# Altium project X-Sub_Board.PrjPcb
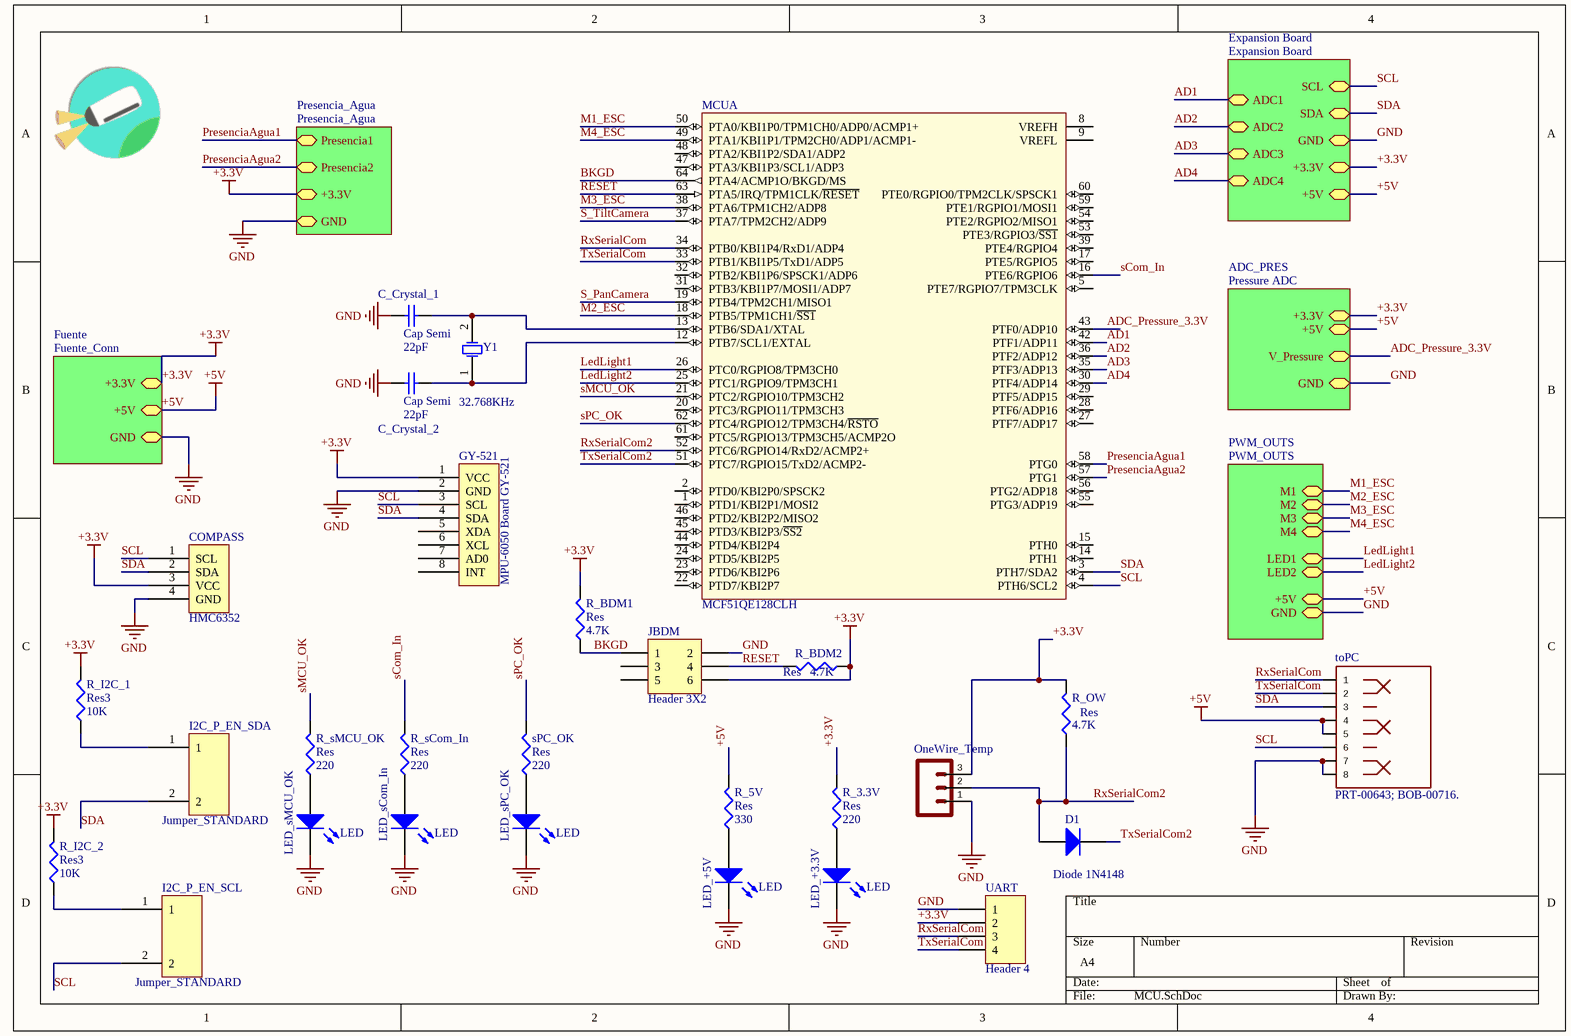
[diagram p0: MCU.SchDoc]
5 sheets, 44 parts. Net scope: hierarchical (ports join the sheet entries above them; power ports are global).
Board file: MCU.PcbDoc
Sheets:
  MCU.SchDoc
    Fuente = Fuente_Conn.SchDoc
    Expansion Board = Expansion Board.SchDoc
    ADC_PRES = Pressure ADC.SchDoc
    Presencia_Agua = Presencia_Agua.SchDoc

## Sheet MCU.SchDoc
size A4; PageSetup: Record=PageOptions|CenterHorizontal=True|CenterVertical=True|PrintScale=0.98|XCorrection=1.00|YCorrection=1.00|PrintKind=1|BorderSize=5000000|LeftOffset=0|BottomOffset=0|Orientation=2|PaperLength=1000|PaperWidth=1000|Scale=100|PaperSource=7|PrintQuality=-3|MediaType=1|DitherType=10|PrintScaleMode=1|PaperKind=Carta|PaperIndex=1

### Parts
C_Crystal_1  Cap Semi  value 22pF  [1608[0603]]
C_Crystal_2  Cap Semi  value 22pF  [1608[0603]]
COMPASS  HMC6352  [HMC6352_SF]
D1  Diode 1N4148  [DO-35]
GY-521  MPU-6050 Board GY-521  [GY-521]
I2C_P_EN_SCL  Jumper_STANDARD  [HDR1X2]
I2C_P_EN_SDA  Jumper_STANDARD  [HDR1X2]
JBDM  Header 3X2  [HDR2X3]
LED_+3.3V  LED  [3.2X1.6X1.1]
LED_+5V  LED  [3.2X1.6X1.1]
LED_sCom_In  LED  [3.2X1.6X1.1]
LED_sMCU_OK  LED  [3.2X1.6X1.1]
LED_sPC_OK  LED  [3.2X1.6X1.1]
MCU  MCF51QE128CLH  [840F-02_N]  (part A of 2)
OneWire_Temp  (no value)  [SCREWTERMINAL-5MM-3]
R_3.3V  Res  value 220  [RESC6332]
R_5V  Res  value 330  [RESC6332]
R_BDM1  Res  value 4.7K  [RESC6332]
R_BDM2  Res  value 4.7K  [RESC6332]
R_I2C_1  Res3  value 10K  [RESC6332]
R_I2C_2  Res3  value 10K  [RESC6332]
R_OW  Res  value 4.7K  [RESC6332]
R_sCom_In  Res  value 220  [RESC6332]
R_sMCU_OK  Res  value 220  [RESC6332]
sPC_OK  Res  value 220  [RESC6332]
toPC  PRT-00643; BOB-00716.  [RJ45-8]
UART  Header 4  [HDR1X4]
Y1  32.768KHz  [R38]

### Sub-sheets
ADC_PRES = Pressure ADC: +3.3V, GND, V_Pressure, +5V
Expansion Board = Expansion Board: SCL, SDA, GND, +3.3V, +5V, ADC4, ADC1, ADC2, ADC3
Fuente = Fuente_Conn: +3.3V, +5V, GND
Presencia_Agua = Presencia_Agua: GND, +3.3V, Presencia2, Presencia1
PWM_OUTS = PWM_OUTS (file not in this document): M1, M2, M3, M4, LED1, LED2, +5V, GND

### Nets
+3.3V: COMPASS.3(VCC) GY-521.1(VCC) JBDM.6 OneWire_Temp.3 R_3.3V.2 R_BDM1.2 R_BDM2.1 R_I2C_1.2 R_I2C_2.2 R_OW.2 UART.2 ; sheet Fuente/+3.3V, sheet Expansion Board/+3.3V, sheet ADC_PRES/+3.3V, sheet Presencia_Agua/+3.3V
+5V: R_5V.2 toPC.4 toPC.5 ; sheet Fuente/+5V, sheet Expansion Board/+5V, sheet ADC_PRES/+5V, sheet PWM_OUTS/+5V
GND: C_Crystal_1.1 C_Crystal_2.1 COMPASS.4(GND) GY-521.2(GND) JBDM.2 LED_+3.3V.2(K) LED_+5V.2(K) LED_sCom_In.2(K) LED_sMCU_OK.2(K) LED_sPC_OK.2(K) OneWire_Temp.1 toPC.7 toPC.8 UART.1 ; sheet Fuente/GND, sheet Expansion Board/GND, sheet ADC_PRES/GND, sheet PWM_OUTS/GND, sheet Presencia_Agua/GND
AD1: MCU.42(PTF1/ADP11) ; sheet Expansion Board/ADC1
AD2: MCU.36(PTF2/ADP12) ; sheet Expansion Board/ADC2
AD3: MCU.35(PTF3/ADP13) ; sheet Expansion Board/ADC3
AD4: MCU.30(PTF4/ADP14) ; sheet Expansion Board/ADC4
ADC_Pressure_3.3V: MCU.43(PTF0/ADP10) ; sheet ADC_PRES/V_Pressure
BKGD: JBDM.1 MCU.64(PTA4/ACMP1O/BKGD/MS) R_BDM1.1
LedLight1: MCU.26(PTC0/RGPIO8/TPM3CH0) ; sheet PWM_OUTS/LED1
LedLight2: MCU.25(PTC1/RGPIO9/TPM3CH1) ; sheet PWM_OUTS/LED2
M1_ESC: MCU.50(PTA0/KBI1P0/TPM1CH0/ADP0/ACMP1+) ; sheet PWM_OUTS/M1
M2_ESC: MCU.18(PTB5/TPM1CH1/~{SS1}) ; sheet PWM_OUTS/M2
M3_ESC: MCU.38(PTA6/TPM1CH2/ADP8) ; sheet PWM_OUTS/M3
M4_ESC: MCU.49(PTA1/KBI1P1/TPM2CH0/ADP1/ACMP1-) ; sheet PWM_OUTS/M4
PresenciaAgua1: MCU.58(PTG0) ; sheet Presencia_Agua/Presencia1
PresenciaAgua2: MCU.57(PTG1) ; sheet Presencia_Agua/Presencia2
RESET: JBDM.4 MCU.63(PTA5/IRQ/TPM1CLK/~{RESET}) R_BDM2.2
RxSerialCom: MCU.34(PTB0/KBI1P4/RxD1/ADP4) toPC.1 UART.3
RxSerialCom2: D1.1(A) MCU.52(PTC6/RGPIO14/RxD2/ACMP2+) OneWire_Temp.2 R_OW.1
S_PanCamera: MCU.19(PTB4/TPM2CH1/MISO1)
S_TiltCamera: MCU.37(PTA7/TPM2CH2/ADP9)
SCL: COMPASS.1(SCL) GY-521.3(SCL) I2C_P_EN_SCL.2 MCU.4(PTH6/SCL2) toPC.6 ; sheet Expansion Board/SCL
sCom_In: MCU.16(PTE6/RGPIO6) R_sCom_In.2
SDA: COMPASS.2(SDA) GY-521.4(SDA) I2C_P_EN_SDA.2 MCU.3(PTH7/SDA2) toPC.3 ; sheet Expansion Board/SDA
sMCU_OK: MCU.21(PTC2/RGPIO10/TPM3CH2) R_sMCU_OK.2
sPC_OK: MCU.62(PTC4/RGPIO12/TPM3CH4/~{RSTO}) sPC_OK.2
TxSerialCom: MCU.33(PTB1/KBI1P5/TxD1/ADP5) toPC.2 UART.4
TxSerialCom2: D1.2(K) MCU.51(PTC7/RGPIO15/TxD2/ACMP2-)
NetC_Crystal_1_2: C_Crystal_1.2 MCU.13(PTB6/SDA1/XTAL) Y1.2(OSC2)
NetC_Crystal_2_2: C_Crystal_2.2 MCU.12(PTB7/SCL1/EXTAL) Y1.1(OSC1)
NetI2C_P_EN_SCL_1: I2C_P_EN_SCL.1 R_I2C_2.1
NetI2C_P_EN_SDA_1: I2C_P_EN_SDA.1 R_I2C_1.1
NetLED_+3.3V_1: LED_+3.3V.1(A) R_3.3V.1
NetLED_+5V_1: LED_+5V.1(A) R_5V.1
NetLED_sCom_In_1: LED_sCom_In.1(A) R_sCom_In.1
NetLED_sMCU_OK_1: LED_sMCU_OK.1(A) R_sMCU_OK.1
NetLED_sPC_OK_1: LED_sPC_OK.1(A) sPC_OK.1

Not connected (* = marked no-connect by the designer): GY-521 5(XDA) 6(XCL) 7(AD0) 8(INT); JBDM 3 5; MCU 1(PTD1/KBI2P1/MOSI2) 2(PTD0/KBI2P0/SPSCK2) 5(PTE7/RGPIO7/TPM3CLK) 8(VREFH) 9(VREFL) 14(PTH1) 15(PTH0) 17(PTE5/RGPIO5) 20(PTC3/RGPIO11/TPM3CH3) 22(PTD7/KBI2P7) 23(PTD6/KBI2P6) 24(PTD5/KBI2P5) 27(PTF7/ADP17) 28(PTF6/ADP16) 29(PTF5/ADP15) 31(PTB3/KBI1P7/MOSI1/ADP7) 32(PTB2/KBI1P6/SPSCK1/ADP6) 39(PTE4/RGPIO4) 44(PTD4/KBI2P4) 45(PTD3/KBI2P3/~{SS2}) 46(PTD2/KBI2P2/MISO2) 47(PTA3/KBI1P3/SCL1/ADP3) 48(PTA2/KBI1P2/SDA1/ADP2) 53(PTE3/RGPIO3/~{SS1}) 54(PTE2/RGPIO2/MISO1) 55(PTG3/ADP19) 56(PTG2/ADP18) 59(PTE1/RGPIO1/MOSI1) 60(PTE0/RGPIO0/TPM2CLK/SPSCK1) 61(PTC5/RGPIO13/TPM3CH5/ACMP2O)

### Library data of the parts
C_Crystal_1 C_Crystal_2 = Cap Semi: Capacitor (Semiconductor SIM Model); Published: 8-Jun-2000; LatestRevisionDate: 29-May-2009; LatestRevisionNote: IPC-7351 Footprint Added.; PackageReference: C1206; Publisher: Altium Limited; PackageDescription: Chip Capacitor
D1 = Diode 1N4148: High Conductance Fast Diode; Published: 8-Jun-2000; LatestRevisionDate: 17-Jul-2002; LatestRevisionNote: Re-released for DXP Platform.; DatasheetVersion: 1997; PackageReference: DO-35; Publisher: Altium Limited; PackageDescription: Diode, Axial; Body 3.8 x 1.9 mm (LxDia. max), Lead Dia. 0.53 mm (max); Code_JEDEC: DO-204-AH; ComponentLink1Description: Manufacturer Link; ComponentLink1URL: http://www.fairchildsemi.com/; ComponentLink2Description: Datasheet; ComponentLink2URL: http://www.fairchildsemi.com/ds/1N%2F1N4148.pdf
GY-521 = GY-521
I2C_P_EN_SCL I2C_P_EN_SDA = Jumper_STANDAR
JBDM = Header 3X2: Header, 3-Pin, Dual row; LatestRevisionDate: 17-Jul-2002; LatestRevisionNote: Re-released for DXP Platform.; Publisher: Altium Limited
LED_+3.3V LED_+5V LED_sCom_In LED_sMCU_OK LED_sPC_OK = LED2: Typical RED, GREEN, YELLOW, AMBER GaAs LED; Published: 8-Jun-2000; LatestRevisionDate: 17-Jul-2002; LatestRevisionNote: Re-released for DXP Platform.; PackageVersion: Feb-2002; PackageReference: 3.2X1.6X1.1; Publisher: Altium Limited; PackageDescription: SM LED; 2 Flat Leads
MCU = MCF51QE128CLH: MCF51QE128 ColdFire V1 Microcontroller, 32-Bit, 128KB Flash, 8KB RAM, -40°C to 85°C, 64-Pin LQFP; DatasheetVersion: rev7, Oct-2008; PackageVersion: rev6, Mar-2011; PackageReference: 840F-02; PackageDescription: 64-Pin Thin Quad Flat Pack, 10 x 10 mm Body, 0.5 mm Pitch; ComponentLink1Description: Manufacturer URL; ComponentLink1URL: http://www.freescale.com/; ComponentLink2Description: Datasheet; ComponentLink2URL: http://cache.freescale.com/files/32bit/doc/data_sheet/MCF51QE128.pdf?fpsp=1&WT_TYPE=Data%20Sheets&WT_VENDOR=FREESCALE&WT_FILE_FORMAT=pdf&WT_ASSET=Documentation
OneWire_Temp = M03-SCREW-5MM: STOREFRONT_ID: PRT-08433
R_3.3V R_5V R_BDM1 R_BDM2 R_I2C_1 R_I2C_2 R_OW R_sCom_In R_sMCU_OK sPC_OK = Res3: Resistor; Published: 8-Jun-2000; LatestRevisionDate: 29-May-2009; LatestRevisionNote: IPC-7351 Footprint Added.; PackageReference: J1-0603; Publisher: Altium Limited; PackageDescription: Chip Resistor
toPC = RJ45-8PTH: PROD_ID: CONN-08506
UART = Header 4: Header, 4-Pin; LatestRevisionDate: 17-Jul-2002; LatestRevisionNote: Re-released for DXP Platform.; Publisher: Altium Limited
Y1 = XTAL: Crystal Oscillator; Published: 8-Jun-2000; LatestRevisionDate: 17-Jul-2002; LatestRevisionNote: Re-released for DXP Platform.; PackageReference: R38; Publisher: Altium Limited; PackageDescription: Crystal, Thru-Hole; 2 Leads; Body 3.1 x 8.2 mm (Dia.xH)

## Sheet Fuente_Conn.SchDoc
size Letter
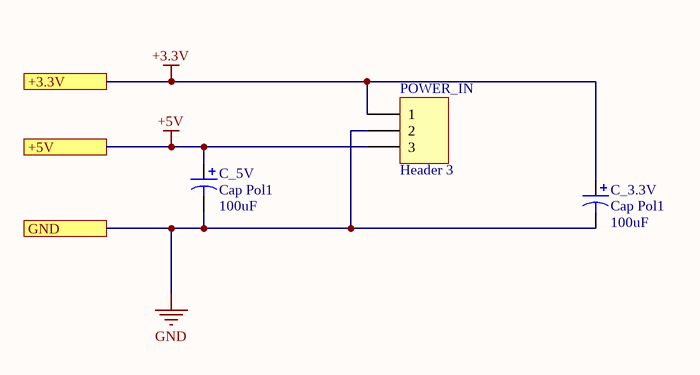
[diagram p1: Fuente_Conn.SchDoc]

### Parts
C_3.3V  Cap Pol1  value 100uF  [CAPR5-4X5]
C_5V  Cap Pol1  value 100uF  [CAPR5-4X5]
POWER_IN  Header 3  [HDR1X3]

### Ports
+3.3V, +5V, GND

### Nets
+3.3V: C_3.3V.1 POWER_IN.1 ; port +3.3V
+5V: C_5V.1 POWER_IN.3 ; port +5V
GND: C_3.3V.2 C_5V.2 POWER_IN.2 ; port GND

### Library data of the parts
C_3.3V C_5V = Cap Pol1: Polarized Capacitor (Radial); Published: 8-Jun-2000; LatestRevisionDate: 17-Jul-2002; LatestRevisionNote: Re-released for DXP Platform.; PackageReference: RB7.6-15; Publisher: Altium Limited; PackageDescription: Polarized Capacitor (Radial); 2 Leads
POWER_IN = Header 3: Header, 3-Pin; LatestRevisionDate: 17-Jul-2002; LatestRevisionNote: Re-released for DXP Platform.; Publisher: Altium Limited

## Sheet Expansion Board.SchDoc
size Letter
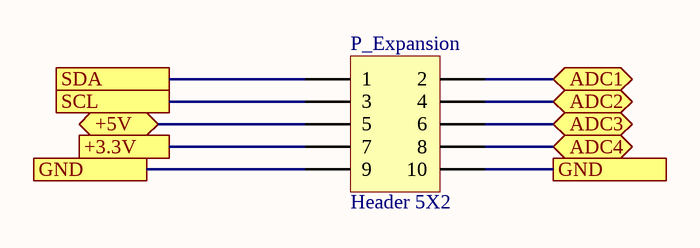
[diagram p2: Expansion Board.SchDoc]

### Parts
P_Expansion  Header 5X2  [HDR2X5]

### Ports
+3.3V, +5V, ADC1, ADC2, ADC3, ADC4, GND, SCL, SDA

### Nets
+3.3V: P_Expansion.7 ; port +3.3V
+5V: P_Expansion.5 ; port +5V
GND: P_Expansion.9 P_Expansion.10 ; port GND
AD1: P_Expansion.2 ; port ADC1
AD2: P_Expansion.4 ; port ADC2
AD3: P_Expansion.6 ; port ADC3
AD4: P_Expansion.8 ; port ADC4
SCL: P_Expansion.3 ; port SCL
SDA: P_Expansion.1 ; port SDA

### Library data of the parts
P_Expansion = Header 5X2: Header, 5-Pin, Dual row; LatestRevisionDate: 17-Jul-2002; LatestRevisionNote: Re-released for DXP Platform.; Publisher: Altium Limited

## Sheet Pressure ADC.SchDoc
size Letter
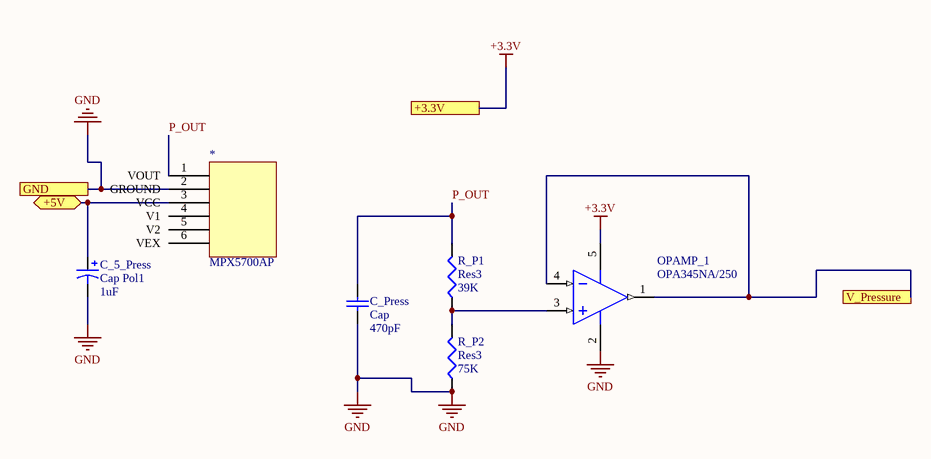
[diagram p3: Pressure ADC.SchDoc]

### Parts
C_5_Press  Cap Pol1  value 1uF  [RB7.6-15]
C_Press  Cap  value 470pF  [3.2X1.6X1.1]
OPAMP_1  OPA345NA/250  [TI-DBV5_N]
R_P1  Res3  value 39K  [J1-0603]
R_P2  Res3  value 75K  [J1-0603]
Sensor_Pres  MPX5700AP  [HDR1X6H]

### Ports
+3.3V, +5V, GND, V_Pressure

### Nets
+3.3V: OPAMP_1.5(V+) ; port +3.3V
+5V: C_5_Press.1 ; port +5V
GND: C_5_Press.2 C_Press.1 OPAMP_1.2(V-) R_P2.1 ; port GND
ADC_Pressure_3.3V: OPAMP_1.1(OUT) OPAMP_1.4(IN-) ; port V_Pressure
P_OUT: C_Press.2 R_P1.2
NetOPAMP_1_3: OPAMP_1.3(IN+) R_P1.1 R_P2.2

Not connected (* = marked no-connect by the designer): Sensor_Pres 1(VOUT) 2(GROUND) 3(VCC) 4(V1) 5(V2) 6(VEX)

### Library data of the parts
C_5_Press = Cap Pol1: Polarized Capacitor (Radial); Published: 8-Jun-2000; LatestRevisionDate: 17-Jul-2002; LatestRevisionNote: Re-released for DXP Platform.; PackageReference: RB7.6-15; Publisher: Altium Limited; PackageDescription: Polarized Capacitor (Radial); 2 Leads
C_Press = Cap: Capacitor; Published: 8-Jun-2000; LatestRevisionDate: 17-Jul-2002; LatestRevisionNote: Re-released for DXP Platform.; PackageReference: RAD-0.3; Publisher: Altium Limited; PackageDescription: Radial Cap, Thru-Hole; 2 Leads; 0.3 in Pin Spacing
OPAMP_1 = OPA345NA/250: Low Power, Single-Supply, Rail-to-Rail Operational Amplifier MicroAmplifier(TM) Series, 2.7 to 5.5 V, -55 to 125 degC, 5-pin SOT23 (DBV5), Green (RoHS & no Sb/Br); Manufacturer: Texas Instruments; CMRR(Min)(dB): 76; IIB(Max)(pA): 10; Iq per channel(Max)(mA): 0.25; Number of Channels: 1; Offset Drift(Typ)(uV/C): 3; Slew Rate(Typ)(V/us): 2; Sub Family: Low Input Bias Current Amp (<=10pA), Low Power Amp (<=500uA), Low Supply Voltage Amplifier (<=2.7V), Precision Amplifier; Total Supply Voltage(Max)(+5V is 5, +/-5V is 10): 5.5; Total Supply Voltage(Min)(+5V is 5, +/-5V is 10): 2.7; DatasheetVersion: SBOS107A; PackageVersion: 4073253-4/K, 03/2006; PackageReference: DBV5; PackageDescription: 5-Pin Plastic Small Outline, Body 1.6 x 2.9 mm, Pitch 0.95 mm; Supplier 1: Digi-Key; Supplier Part Number 1: OPA345NATR-ND; Supplier 2: Digi-Key; Supplier Part Number 2: OPA345NACT-ND; Supplier 3: Digi-Key; Supplier Part Number 3: OPA345NADKR-ND; Supplier 4: Farnell; Supplier Part Number 4: 1648703; Supplier 5: Newark; Supplier Part Number 5: 75C4876; Supplier 6: Mouser; Supplier Part Number 6: 595-OPA345NA/250; Eco-Plan: Green (RoHS & no Sb/Br); Vio (25C)(Max)(mV): 1; Mounting Technology: Surface Mount; Code_JEDEC: MO-178; PartNumber: OPA345NA/250; ComponentLink1Description: Manufacturer URL; ComponentLink1URL: http://www.ti.com/; ComponentLink2Description: Datasheet; ComponentLink2URL: http://www.ti.com/general/docs/lit/getliterature.tsp?genericPartNumber=OPA345&fileType=pdf; ComponentLink3Description: Package Specification; ComponentLink3URL: http://www.ti.com/litv/pdf/mpds018i
R_P1 R_P2 = Res3: Resistor; Published: 8-Jun-2000; LatestRevisionDate: 29-May-2009; LatestRevisionNote: IPC-7351 Footprint Added.; PackageReference: J1-0603; Publisher: Altium Limited; PackageDescription: Chip Resistor

## Sheet Presencia_Agua.SchDoc
size Letter
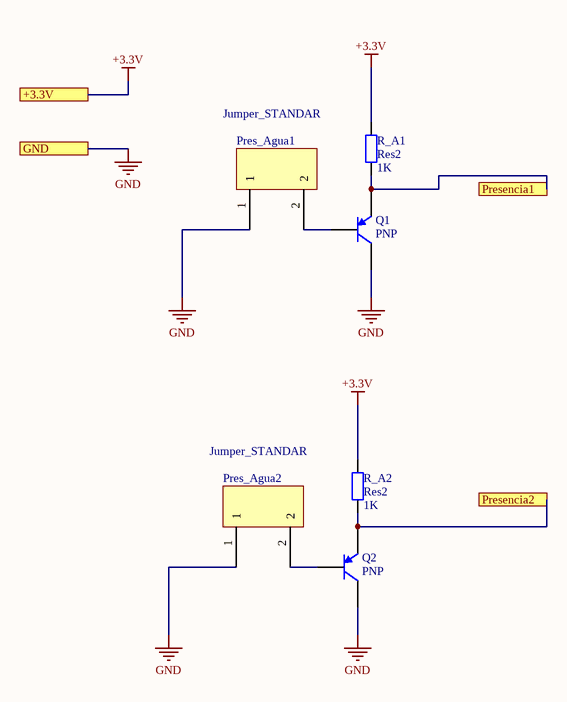
[diagram p4: Presencia_Agua.SchDoc]

### Parts
Pres_Agua1  Jumper_STANDAR  [HDR1X2H]
Pres_Agua2  Jumper_STANDAR  [HDR1X2H]
Q1  PNP  [SOT-23B_N]
Q2  PNP  [SOT-23B_N]
R_A1  Res2  value 1K  [AXIAL-0.4]
R_A2  Res2  value 1K  [AXIAL-0.4]

### Ports
+3.3V, GND, Presencia1, Presencia2

### Nets
+3.3V: R_A1.2 R_A2.2 ; port +3.3V
GND: Pres_Agua1.1 Pres_Agua2.1 Q1.1(C) Q2.1(C) ; port GND
PresenciaAgua1: Q1.3(E) R_A1.1 ; port Presencia1
PresenciaAgua2: Q2.3(E) R_A2.1 ; port Presencia2
NetPres_Agua1_2: Pres_Agua1.2 Q1.2(B)
NetPres_Agua2_2: Pres_Agua2.2 Q2.2(B)

### Library data of the parts
Q1 Q2 = PNP: PNP Bipolar Transistor; Published: 8-Jun-2000; LatestRevisionDate: 29-May-2009; LatestRevisionNote: IPC-7351 Footprint Added.; PackageVersion: Aug-1999; PackageReference: SOT-23B; Publisher: Altium Limited; PackageDescription: 3-Pin SOT-23 Package 0.95 mm Pitch, 2.4 mm Lead Span
R_A1 R_A2 = Res2: Resistor; Published: 8-Jun-2000; LatestRevisionDate: 17-Jul-2002; LatestRevisionNote: Re-released for DXP Platform.; PackageReference: AXIAL-0.4; Publisher: Altium Limited; PackageDescription: Axial Device, Thru-Hole; 2 Leads; 0.4 in Pin Spacing

## Nets that join several sheets
+3.3V: MCU (11 pins), Fuente_Conn (C_3.3V.1 POWER_IN.1), Expansion Board (P_Expansion.7), Pressure ADC (OPAMP_1.5), Presencia_Agua (R_A1.2 R_A2.2)
+5V: MCU (R_5V.2 toPC.4 toPC.5), Fuente_Conn (C_5V.1 POWER_IN.3), Expansion Board (P_Expansion.5), Pressure ADC (C_5_Press.1)
GND: MCU (14 pins), Fuente_Conn (C_3.3V.2 C_5V.2 POWER_IN.2), Expansion Board (P_Expansion.9 P_Expansion.10), Pressure ADC (C_5_Press.2 C_Press.1 OPAMP_1.2 R_P2.1), Presencia_Agua (Pres_Agua1.1 Pres_Agua2.1 Q1.1 Q2.1)
AD1: MCU (MCU.42), Expansion Board (P_Expansion.2)
AD2: MCU (MCU.36), Expansion Board (P_Expansion.4)
AD3: MCU (MCU.35), Expansion Board (P_Expansion.6)
AD4: MCU (MCU.30), Expansion Board (P_Expansion.8)
ADC_Pressure_3.3V: MCU (MCU.43), Pressure ADC (OPAMP_1.1 OPAMP_1.4)
PresenciaAgua1: MCU (MCU.58), Presencia_Agua (Q1.3 R_A1.1)
PresenciaAgua2: MCU (MCU.57), Presencia_Agua (Q2.3 R_A2.1)
SCL: MCU (5 pins), Expansion Board (P_Expansion.3)
SDA: MCU (5 pins), Expansion Board (P_Expansion.1)